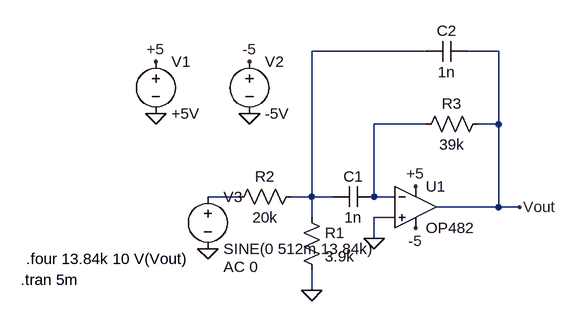
[diagram p0: schematic Etaj2TRANS.asc]
Etaj2TRANS.asc, the LTspice schematic file:
Version 4.1
SHEET 1 880 680
WIRE 336 32 160 32
WIRE 448 32 400 32
WIRE 336 144 256 144
WIRE 448 144 448 32
WIRE 448 144 416 144
WIRE 48 256 0 256
WIRE 160 256 160 32
WIRE 160 256 128 256
WIRE 192 256 160 256
WIRE 256 256 256 144
WIRE 288 256 256 256
WIRE 448 272 448 144
WIRE 448 272 352 272
WIRE 480 272 448 272
WIRE 160 288 160 256
WIRE 288 288 256 288
WIRE 256 320 256 288
WIRE 160 400 160 368
FLAG 256 320 0
FLAG 160 400 0
FLAG 480 272 Vout
FLAG 320 240 +5
FLAG 320 304 -5
FLAG -80 128 0
FLAG 64 128 0
FLAG -80 48 +5
FLAG 64 48 -5
FLAG 0 336 0
SYMBOL OpAmps\\OP482 320 208 R0
SYMATTR InstName U1
SYMBOL cap 256 240 R90
WINDOW 0 0 32 VBottom 2
WINDOW 3 32 32 VTop 2
SYMATTR InstName C1
SYMATTR Value 1n
SYMBOL res 144 272 R0
SYMATTR InstName R1
SYMATTR Value 3.9k
SYMBOL res 144 240 R90
WINDOW 0 0 56 VBottom 2
WINDOW 3 32 56 VTop 2
SYMATTR InstName R2
SYMATTR Value 20k
SYMBOL res 432 128 R90
WINDOW 0 0 56 VBottom 2
WINDOW 3 32 56 VTop 2
SYMATTR InstName R3
SYMATTR Value 39k
SYMBOL cap 400 16 R90
WINDOW 0 0 32 VBottom 2
WINDOW 3 32 32 VTop 2
SYMATTR InstName C2
SYMATTR Value 1n
SYMBOL voltage -80 32 R0
SYMATTR InstName V1
SYMATTR Value +5V
SYMBOL voltage 64 32 R0
SYMATTR InstName V2
SYMATTR Value -5V
SYMBOL voltage 0 240 R0
WINDOW 123 24 124 Left 2
WINDOW 39 0 0 Left 0
SYMATTR Value2 AC 0
SYMATTR InstName V3
SYMATTR Value SINE(0 512m 13.84k)
TEXT -288 384 Left 2 !.tran 5m
TEXT -280 352 Left 2 !.four 13.84k 10 V(Vout)

The netlist it stands for:
* Etaj2TRANS.asc
X§U1 0 N002 +5 -5 Vout OP482  ; pins In+ In- V+ V- OUT
C1 N002 N001 1n
R1 N001 0 3.9k
R2 N001 N003 20k
R3 Vout N002 39k
C2 Vout N001 1n
V1 +5 0 +5V
V2 -5 0 -5V
V3 N003 0 SINE(0 512m 13.84k) AC 0
.tran 5m
.four 13.84k 10 V(Vout)
.backanno
.end